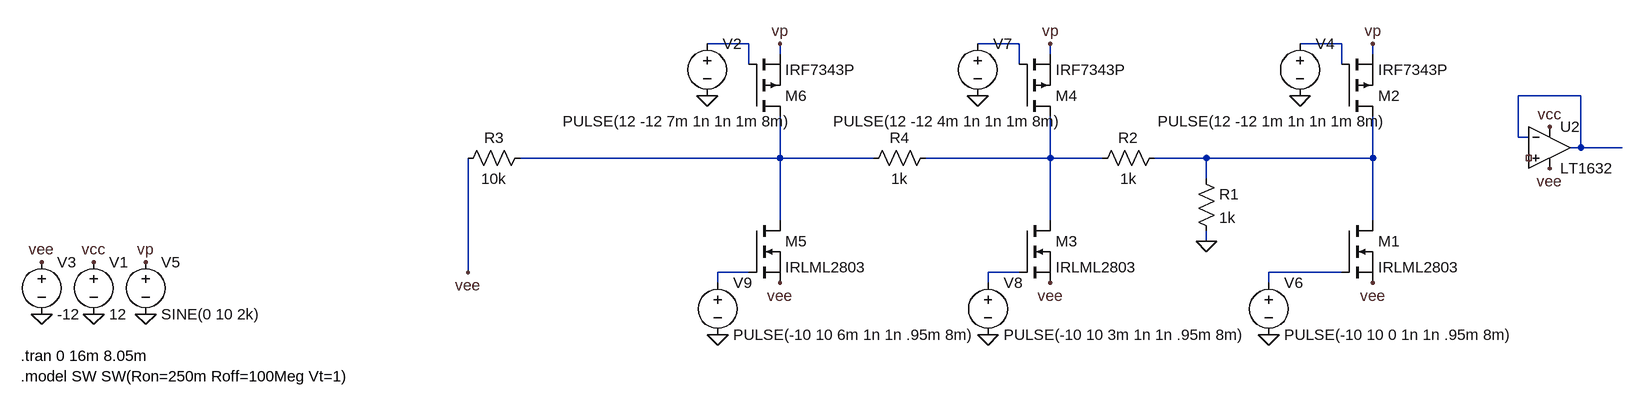
[diagram p0: schematic voltage-default.asc]
voltage-default.asc, the LTspice schematic file:
Version 4
SHEET 1 1364 680
WIRE 16 -16 -48 -16
WIRE 432 -16 368 -16
WIRE 928 -16 864 -16
WIRE 64 0 64 -16
WIRE 480 0 480 -16
WIRE 976 0 976 -16
WIRE 16 16 16 -16
WIRE 432 16 432 -16
WIRE 928 16 928 -16
WIRE 1296 64 1200 64
WIRE 1200 128 1200 64
WIRE 1216 128 1200 128
WIRE 1296 144 1296 64
WIRE 1296 144 1280 144
WIRE 1360 144 1296 144
WIRE 64 160 64 96
WIRE 64 160 -336 160
WIRE 208 160 64 160
WIRE 480 160 480 96
WIRE 480 160 288 160
WIRE 560 160 480 160
WIRE 720 160 640 160
WIRE 976 160 976 96
WIRE 976 160 720 160
WIRE 720 192 720 160
WIRE 64 256 64 160
WIRE 480 256 480 160
WIRE 976 256 976 160
WIRE 720 288 720 272
WIRE -416 336 -416 160
WIRE 16 336 -32 336
WIRE 432 336 384 336
WIRE 928 336 816 336
WIRE -32 352 -32 336
WIRE 384 352 384 336
WIRE 816 352 816 336
FLAG -992 400 0
FLAG -992 320 vcc
FLAG 1248 112 vcc
FLAG -1072 400 0
FLAG -1072 320 vee
FLAG 1248 176 vee
FLAG 864 64 0
FLAG -912 400 0
FLAG 816 432 0
FLAG 976 352 vee
FLAG -912 320 vp
FLAG 976 -16 vp
FLAG 368 64 0
FLAG 384 432 0
FLAG 480 352 vee
FLAG 480 -16 vp
FLAG -48 64 0
FLAG -32 432 0
FLAG 64 352 vee
FLAG 64 -16 vp
FLAG -416 336 vee
FLAG 720 288 0
SYMBOL voltage -992 304 R0
WINDOW 123 0 0 Left 2
WINDOW 39 0 0 Left 2
SYMATTR InstName V1
SYMATTR Value 12
SYMBOL res 704 176 R0
SYMATTR InstName R1
SYMATTR Value 1k
SYMBOL res 544 176 R270
WINDOW 0 32 56 VTop 2
WINDOW 3 0 56 VBottom 2
SYMATTR InstName R2
SYMATTR Value 1k
SYMBOL voltage -1072 304 R0
WINDOW 123 0 0 Left 2
WINDOW 39 0 0 Left 2
SYMATTR InstName V3
SYMATTR Value -12
SYMBOL voltage 864 -32 R0
WINDOW 123 0 0 Left 2
WINDOW 39 0 0 Left 2
WINDOW 3 -219 135 Left 2
SYMATTR Value PULSE(12 -12 1m 1n 1n 1m 8m)
SYMATTR InstName V4
SYMBOL voltage -912 304 R0
WINDOW 123 0 0 Left 2
WINDOW 39 0 0 Left 2
SYMATTR InstName V5
SYMATTR Value SINE(0 10 2k)
SYMBOL nmos 928 256 R0
SYMATTR InstName M1
SYMATTR Value IRLML2803
SYMBOL voltage 816 336 R0
WINDOW 123 0 0 Left 2
WINDOW 39 0 0 Left 2
SYMATTR InstName V6
SYMATTR Value PULSE(-10 10 0 1n 1n .95m 8m)
SYMBOL res -320 144 R90
WINDOW 0 0 56 VBottom 2
WINDOW 3 32 56 VTop 2
SYMATTR InstName R3
SYMATTR Value 10k
SYMBOL res 304 144 R90
WINDOW 0 0 56 VBottom 2
WINDOW 3 32 56 VTop 2
SYMATTR InstName R4
SYMATTR Value 1k
SYMBOL pmos 928 96 M180
SYMATTR InstName M2
SYMATTR Value IRF7343P
SYMBOL Opamps\\LT1632 1248 80 R0
SYMATTR InstName U2
SYMBOL voltage 368 -32 R0
WINDOW 123 0 0 Left 2
WINDOW 39 0 0 Left 2
WINDOW 3 -222 135 Left 2
SYMATTR Value PULSE(12 -12 4m 1n 1n 1m 8m)
SYMATTR InstName V7
SYMBOL nmos 432 256 R0
SYMATTR InstName M3
SYMATTR Value IRLML2803
SYMBOL voltage 384 336 R0
WINDOW 123 0 0 Left 2
WINDOW 39 0 0 Left 2
SYMATTR InstName V8
SYMATTR Value PULSE(-10 10 3m 1n 1n .95m 8m)
SYMBOL pmos 432 96 M180
SYMATTR InstName M4
SYMATTR Value IRF7343P
SYMBOL voltage -48 -32 R0
WINDOW 123 0 0 Left 2
WINDOW 39 0 0 Left 2
WINDOW 3 -222 135 Left 2
SYMATTR Value PULSE(12 -12 7m 1n 1n 1m 8m)
SYMATTR InstName V2
SYMBOL nmos 16 256 R0
SYMATTR InstName M5
SYMATTR Value IRLML2803
SYMBOL voltage -32 336 R0
WINDOW 123 0 0 Left 2
WINDOW 39 0 0 Left 2
SYMATTR InstName V9
SYMATTR Value PULSE(-10 10 6m 1n 1n .95m 8m)
SYMBOL pmos 16 96 M180
SYMATTR InstName M6
SYMATTR Value IRF7343P
TEXT -1104 464 Left 2 !.tran 0 16m 8.05m
TEXT -1104 496 Left 2 !.model SW SW(Ron=250m Roff=100Meg Vt=1)

The netlist it stands for:
* voltage-default.asc
V1 vcc 0 12
R1 N007 0 1k
R2 N006 N007 1k
V3 vee 0 -12
V4 N003 0 PULSE(12 -12 1m 1n 1n 1m 8m)
V5 vp 0 SINE(0 10 2k)
M1 N007 N010 vee vee IRLML2803
V6 N010 0 PULSE(-10 10 0 1n 1n .95m 8m)
R3 N005 vee 10k
R4 N006 N005 1k
M2 N007 N003 vp vp IRF7343P
XU2 NC_01 N004 vcc vee N004 LT1632  ; pins In+ In- V+ V- OUT
V7 N002 0 PULSE(12 -12 4m 1n 1n 1m 8m)
M3 N006 N009 vee vee IRLML2803
V8 N009 0 PULSE(-10 10 3m 1n 1n .95m 8m)
M4 N006 N002 vp vp IRF7343P
V2 N001 0 PULSE(12 -12 7m 1n 1n 1m 8m)
M5 N005 N008 vee vee IRLML2803
V9 N008 0 PULSE(-10 10 6m 1n 1n .95m 8m)
M6 N005 N001 vp vp IRF7343P
.model NMOS NMOS
.model PMOS PMOS
.lib standard.mos
.tran 0 16m 8.05m
.model SW SW(Ron=250m Roff=100Meg Vt=1)
.lib LTC.lib
.backanno
.end